# EAGLE design new_esplay (EAGLE 9.4.2)

## Sheet 1 of 2: Main Processor
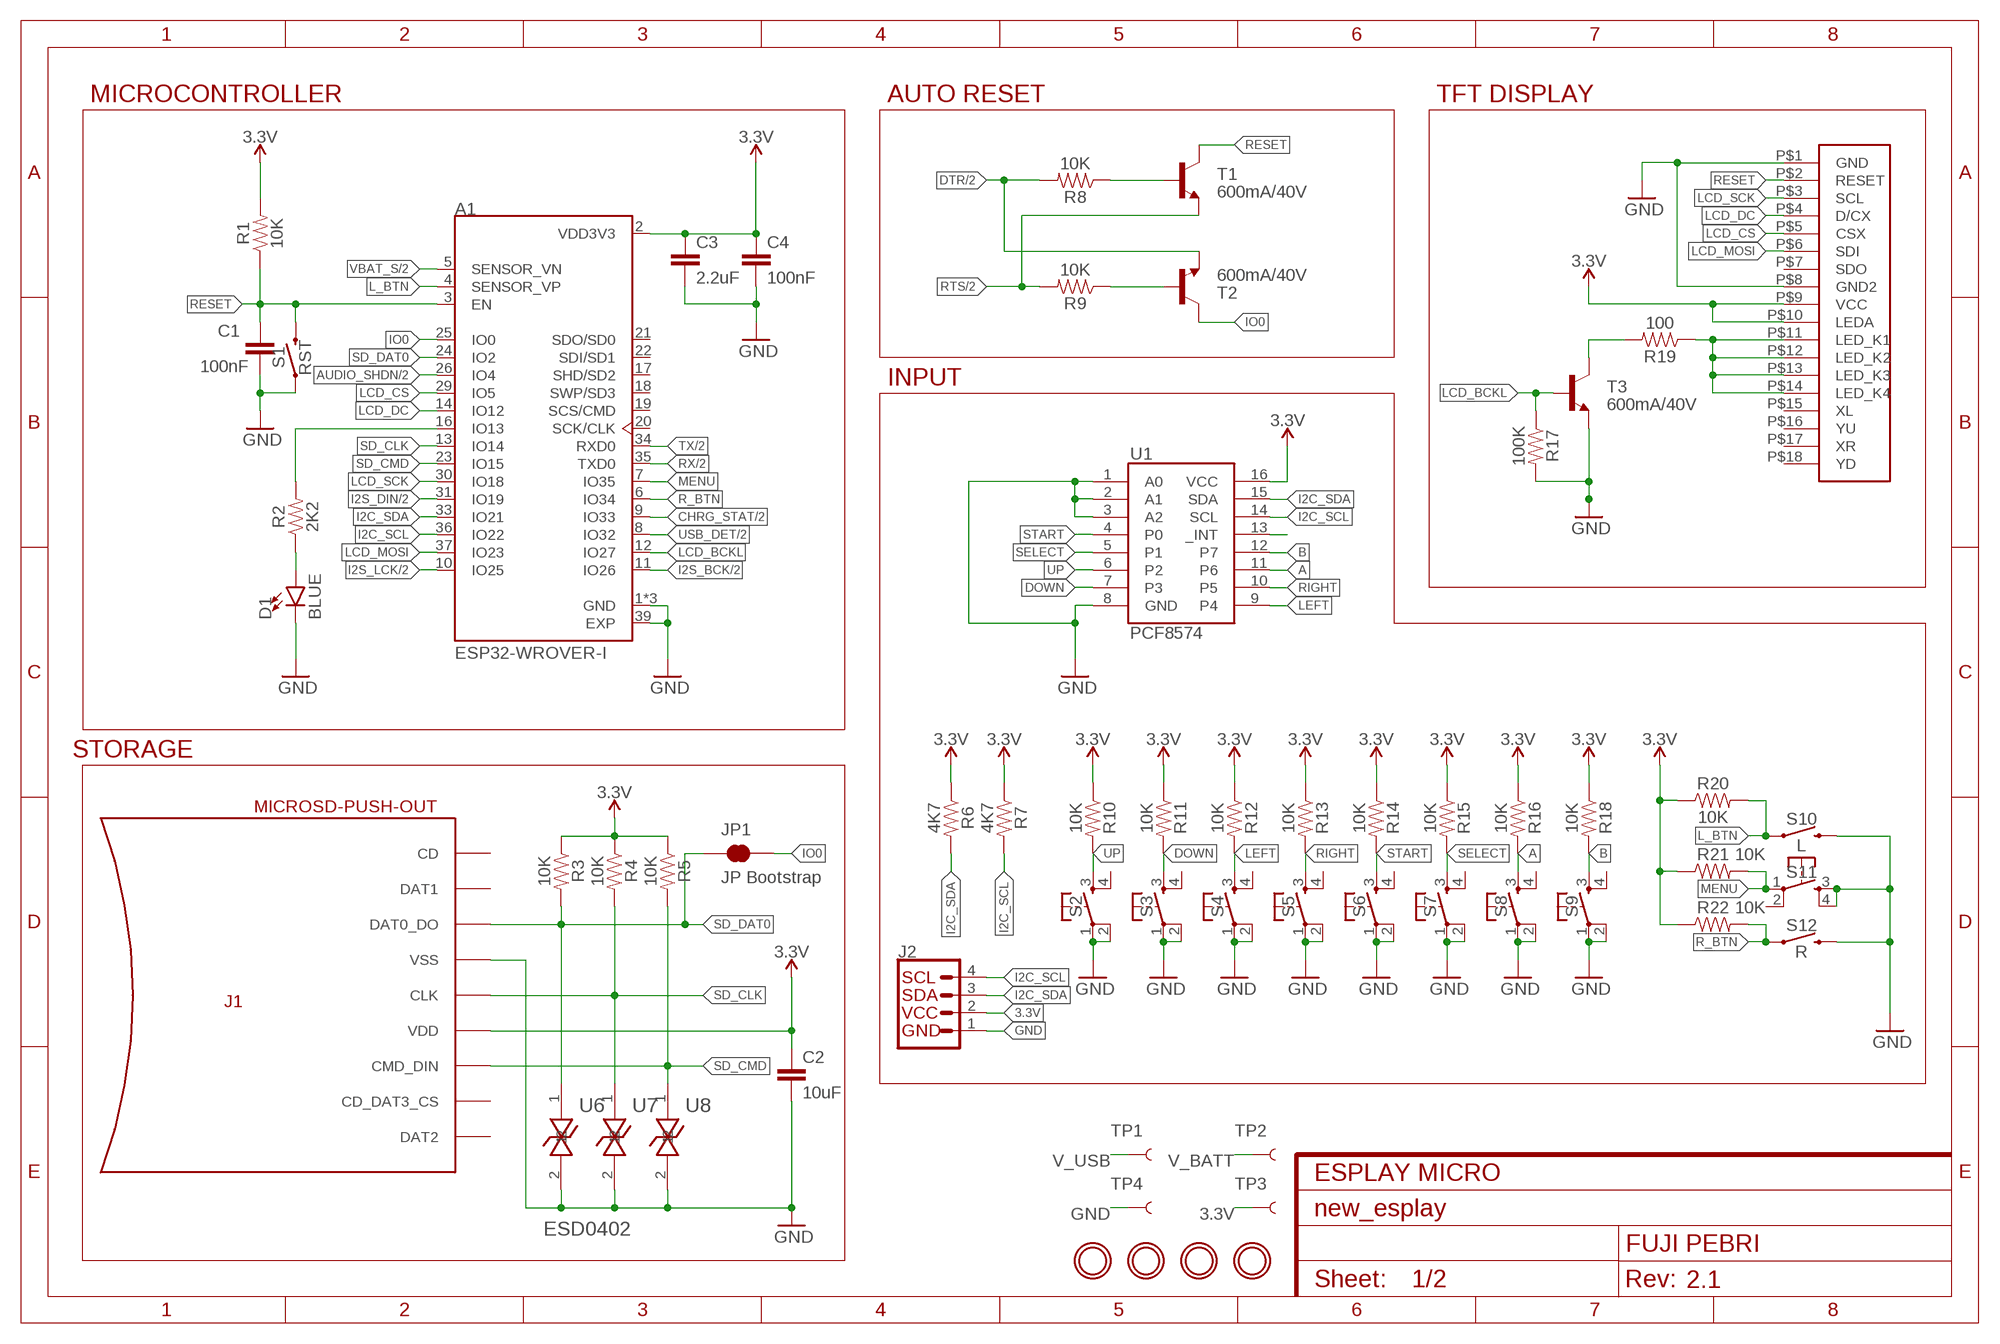
[diagram p0: schematic, sheet 1]
FRAME1 (FRAME-A4L): CNAME: ESPLAY MICRO; CREVISION: 2.1; DESIGNER: FUJI PEBRI

### Parts
A1  ESP32-WROVER-I  [XCVR_ESP32-WROVER-I]
C1  100nF  2.2UF-0805-25V-(+80/-20%)  [0805]
C2  10uF  2.2UF-0805-25V-(+80/-20%)  [0805]
C3  2.2uF  2.2UF-0805-25V-(+80/-20%)  [0805]
C4  100nF  2.2UF-0805-25V-(+80/-20%)  [0805]
D1  BLUE  LED-BLUE0603  [LED-0603]
H1  MICROBUILDER_MOUNTINGHOLE3.0THIN  [MICROBUILDER_MOUNTINGHOLE_3.0_PLATEDTHIN]
H2  MICROBUILDER_MOUNTINGHOLE3.0THIN  [MICROBUILDER_MOUNTINGHOLE_3.0_PLATEDTHIN]
H3  MICROBUILDER_MOUNTINGHOLE3.0THIN  [MICROBUILDER_MOUNTINGHOLE_3.0_PLATEDTHIN]
H4  MICROBUILDER_MOUNTINGHOLE3.0THIN  [MICROBUILDER_MOUNTINGHOLE_3.0_PLATEDTHIN]
J1  MICROSD-PUSH-OUT  [MICROSD-PUSH-OUT]
J2  QWIIC_CONNECTORJS-1MM  [1X04_1MM_RA]
JP1  JP Bootstrap  JUMPER-SMT_2_NC_TRACE_NO-SILK  [SMT-JUMPER_2_NC_TRACE_NO-SILK]
LCD1  ILI9341-2.4  [ILI9341-2.4]
R1  10K  0.22OHM-0805-1/4W-1%  [0805]
R2  2K2  0.22OHM-0805-1/4W-1%  [0805]
R3  10K  0.22OHM-0805-1/4W-1%  [0805]
R4  10K  0.22OHM-0805-1/4W-1%  [0805]
R5  10K  0.22OHM-0805-1/4W-1%  [0805]
R6  4K7  0.22OHM-0805-1/4W-1%  [0805]
R7  4K7  0.22OHM-0805-1/4W-1%  [0805]
R8  10K  0.22OHM-0805-1/4W-1%  [0805]
R9  10K  0.22OHM-0805-1/4W-1%  [0805]
R10  10K  0.22OHM-0805-1/4W-1%  [0805]
R11  10K  0.22OHM-0805-1/4W-1%  [0805]
R12  10K  0.22OHM-0805-1/4W-1%  [0805]
R13  10K  0.22OHM-0805-1/4W-1%  [0805]
R14  10K  0.22OHM-0805-1/4W-1%  [0805]
R15  10K  0.22OHM-0805-1/4W-1%  [0805]
R16  10K  0.22OHM-0805-1/4W-1%  [0805]
R17  100K  0.22OHM-0805-1/4W-1%  [0805]
R18  10K  0.22OHM-0805-1/4W-1%  [0805]
R19  100  0.22OHM-0805-1/4W-1%  [0805]
R20  10K  0.22OHM-0805-1/4W-1%  [0805]
R21  10K  0.22OHM-0805-1/4W-1%  [0805]
R22  10K  0.22OHM-0805-1/4W-1%  [0805]
S1  RST  MOMENTARY-SWITCH-SPST-SMD-4.6X2.8MM  [TACTILE_SWITCH_SMD_4.6X2.8MM]
S2  MOMENTARY-SWITCH-SPST-2-SMD-5.2MM  [TACTILE_SWITCH_SMD_5.2MM]
S3  MOMENTARY-SWITCH-SPST-2-SMD-5.2MM  [TACTILE_SWITCH_SMD_5.2MM]
S4  MOMENTARY-SWITCH-SPST-2-SMD-5.2MM  [TACTILE_SWITCH_SMD_5.2MM]
S5  MOMENTARY-SWITCH-SPST-2-SMD-5.2MM  [TACTILE_SWITCH_SMD_5.2MM]
S6  MOMENTARY-SWITCH-SPST-2-SMD-5.2MM  [TACTILE_SWITCH_SMD_5.2MM]
S7  MOMENTARY-SWITCH-SPST-2-SMD-5.2MM  [TACTILE_SWITCH_SMD_5.2MM]
S8  MOMENTARY-SWITCH-SPST-2-SMD-5.2MM  [TACTILE_SWITCH_SMD_5.2MM]
S9  MOMENTARY-SWITCH-SPST-2-SMD-5.2MM  [TACTILE_SWITCH_SMD_5.2MM]
S10  L  MOMENTARY-SWITCH-SPST-PTH-RIGHT-ANGLE-KIT  [TACTILE_SWITCH_PTH_RIGHT_ANGLE_KIT]
S11  MOMENTARY-SWITCH-SPST-2-SMD-5.2MM  [TACTILE_SWITCH_SMD_5.2MM]
S12  R  MOMENTARY-SWITCH-SPST-PTH-RIGHT-ANGLE-KIT  [TACTILE_SWITCH_PTH_RIGHT_ANGLE_KIT]
T1  600mA/40V  TRANS_NPN-MMBT2222AL  [SOT23-3]
T2  600mA/40V  TRANS_NPN-MMBT2222AL  [SOT23-3]
T3  600mA/40V  TRANS_NPN-MMBT2222AL  [SOT23-3]
TP1  TEST-POINT3  [PAD.03X.03]
TP2  TEST-POINT3  [PAD.03X.03]
TP3  TEST-POINT3  [PAD.03X.03]
TP4  TEST-POINT3  [PAD.03X.03]
U1  PCF8574  [SO16]
U6  ESD0402  [ESD0402]
U7  ESD0402  [ESD0402]
U8  ESD0402  [ESD0402]

### Nets
3.3V [3V3]: A1.2(VDD3V3) C2.1 C3.1 C4.1 J1.4(VDD) J2.2 LCD1.P$9(VCC) LCD1.P$10(LEDA) R1.2 R3.1 R4.1 R5.1 R6.1 R7.1 R10.1 R11.1 R12.1 R13.1 R14.1 R15.1 R16.1 R18.1 R20.1 R21.1 R22.1 TP3.P$1 U1.16(VCC) ; also sheet 2
A: R16.2 S8.3 U1.11(P6)
AUDIO_SHDN: A1.26(IO4) ; also sheet 2
B: R18.2 S9.3 U1.12(P7)
CHRG_STAT: A1.9(IO33) ; also sheet 2
DOWN: R11.2 S3.3 U1.7(P3)
DTR: R8.2 T2.2(E) ; also sheet 2
GND: A1.1(GND) A1.15(GND) A1.38(GND) A1.39(EXP) C1.2 C2.2 C3.2 C4.2 D1.C J1.6(VSS) J1.G1(VSS) J1.G2(VSS) J1.G3(VSS) J1.G4(VSS) J2.1 LCD1.P$1(GND) LCD1.P$8(GND2) R17.2 S1.1 S1.2 S2.1 S2.2 S3.1 S3.2 S4.1 S4.2 S5.1 S5.2 S6.1 S6.2 S7.1 S7.2 S8.1 S8.2 S9.1 S9.2 S10.2 S11.3 S11.4 S12.2 T3.2(E) TP4.P$1 U1.1(A0) U1.2(A1) U1.3(A2) U1.8(GND) U6.2 U7.2 U8.2 ; also sheet 2
I2C_SCL: A1.36(IO22) J2.4 R7.2 U1.14(SCL)
I2C_SDA: A1.33(IO21) J2.3 R6.2 U1.15(SDA)
I2S_BCK: A1.11(IO26) ; also sheet 2
I2S_DIN: A1.31(IO19) ; also sheet 2
I2S_LCK: A1.10(IO25) ; also sheet 2
IO0: A1.25(IO0) JP1.2 T2.3(C)
L_BTN: A1.4(SENSOR_VP) R20.2 S10.1
LCD_BCKL: A1.12(IO27) R17.1 T3.1(B)
LCD_CS: A1.29(IO5) LCD1.P$5(CSX)
LCD_DC: A1.14(IO12) LCD1.P$4(D/CX)
LCD_MOSI: A1.37(IO23) LCD1.P$6(SDI)
LCD_SCK: A1.30(IO18) LCD1.P$3(SCL)
LEFT: R12.2 S4.3 U1.9(P4)
MENU: A1.7(IO35) R21.2 S11.1
N$1: A1.16(IO13) R2.2
N$3: D1.A R2.1
N$9: R19.2 T3.3(C)
N$11: LCD1.P$11(LED_K1) LCD1.P$12(LED_K2) LCD1.P$13(LED_K3) LCD1.P$14(LED_K4) R19.1
N$12: R8.1 T1.1(B)
N$13: R9.1 T2.1(B)
N$33: U1.13(_INT)
R_BTN: A1.6(IO34) R22.2 S12.1
RESET: A1.3(EN) C1.1 LCD1.P$2(RESET) R1.1 S1.3 S1.4 T1.3(C)
RIGHT: R13.2 S5.3 U1.10(P5)
RTS: R9.2 T1.2(E) ; also sheet 2
RX: A1.35(TXD0) ; also sheet 2
SD_CLK: A1.13(IO14) J1.5(CLK) R4.2 U7.1
SD_CMD: A1.23(IO15) J1.3(CMD_DIN) R5.2 U8.1
SD_DAT0: A1.24(IO2) J1.7(DAT0_DO) JP1.1 R3.2 U6.1
SELECT: R15.2 S7.3 U1.5(P1)
START: R14.2 S6.3 U1.4(P0)
TX: A1.34(RXD0) ; also sheet 2
UP: R10.2 S2.3 U1.6(P2)
USB_DET: A1.8(IO32) ; also sheet 2
V_BATT [VBUS]: TP2.P$1 ; also sheet 2
V_USB [VBUS]: TP1.P$1 ; also sheet 2
VBAT_S: A1.5(SENSOR_VN) ; also sheet 2
Unconnected: A1.17(SHD/SD2) A1.18(SWP/SD3) A1.19(SCS/CMD) A1.20(SCK/CLK) A1.21(SDO/SD0) A1.22(SDI/SD1) J1.1(DAT2) J1.2(CD_DAT3_CS) J1.8(DAT1) J1.CD LCD1.P$7(SDO) LCD1.P$15(XL) LCD1.P$16(YU) LCD1.P$17(XR) LCD1.P$18(YD) S2.4 S3.4 S4.4 S5.4 S6.4 S7.4 S8.4 S9.4 S11.2

### Notes on the sheet
- MICROCONTROLLER | AUTO RESET | TFT DISPLAY
- INPUT
- STORAGE

## Sheet 2 of 2: Power Supply and Charger
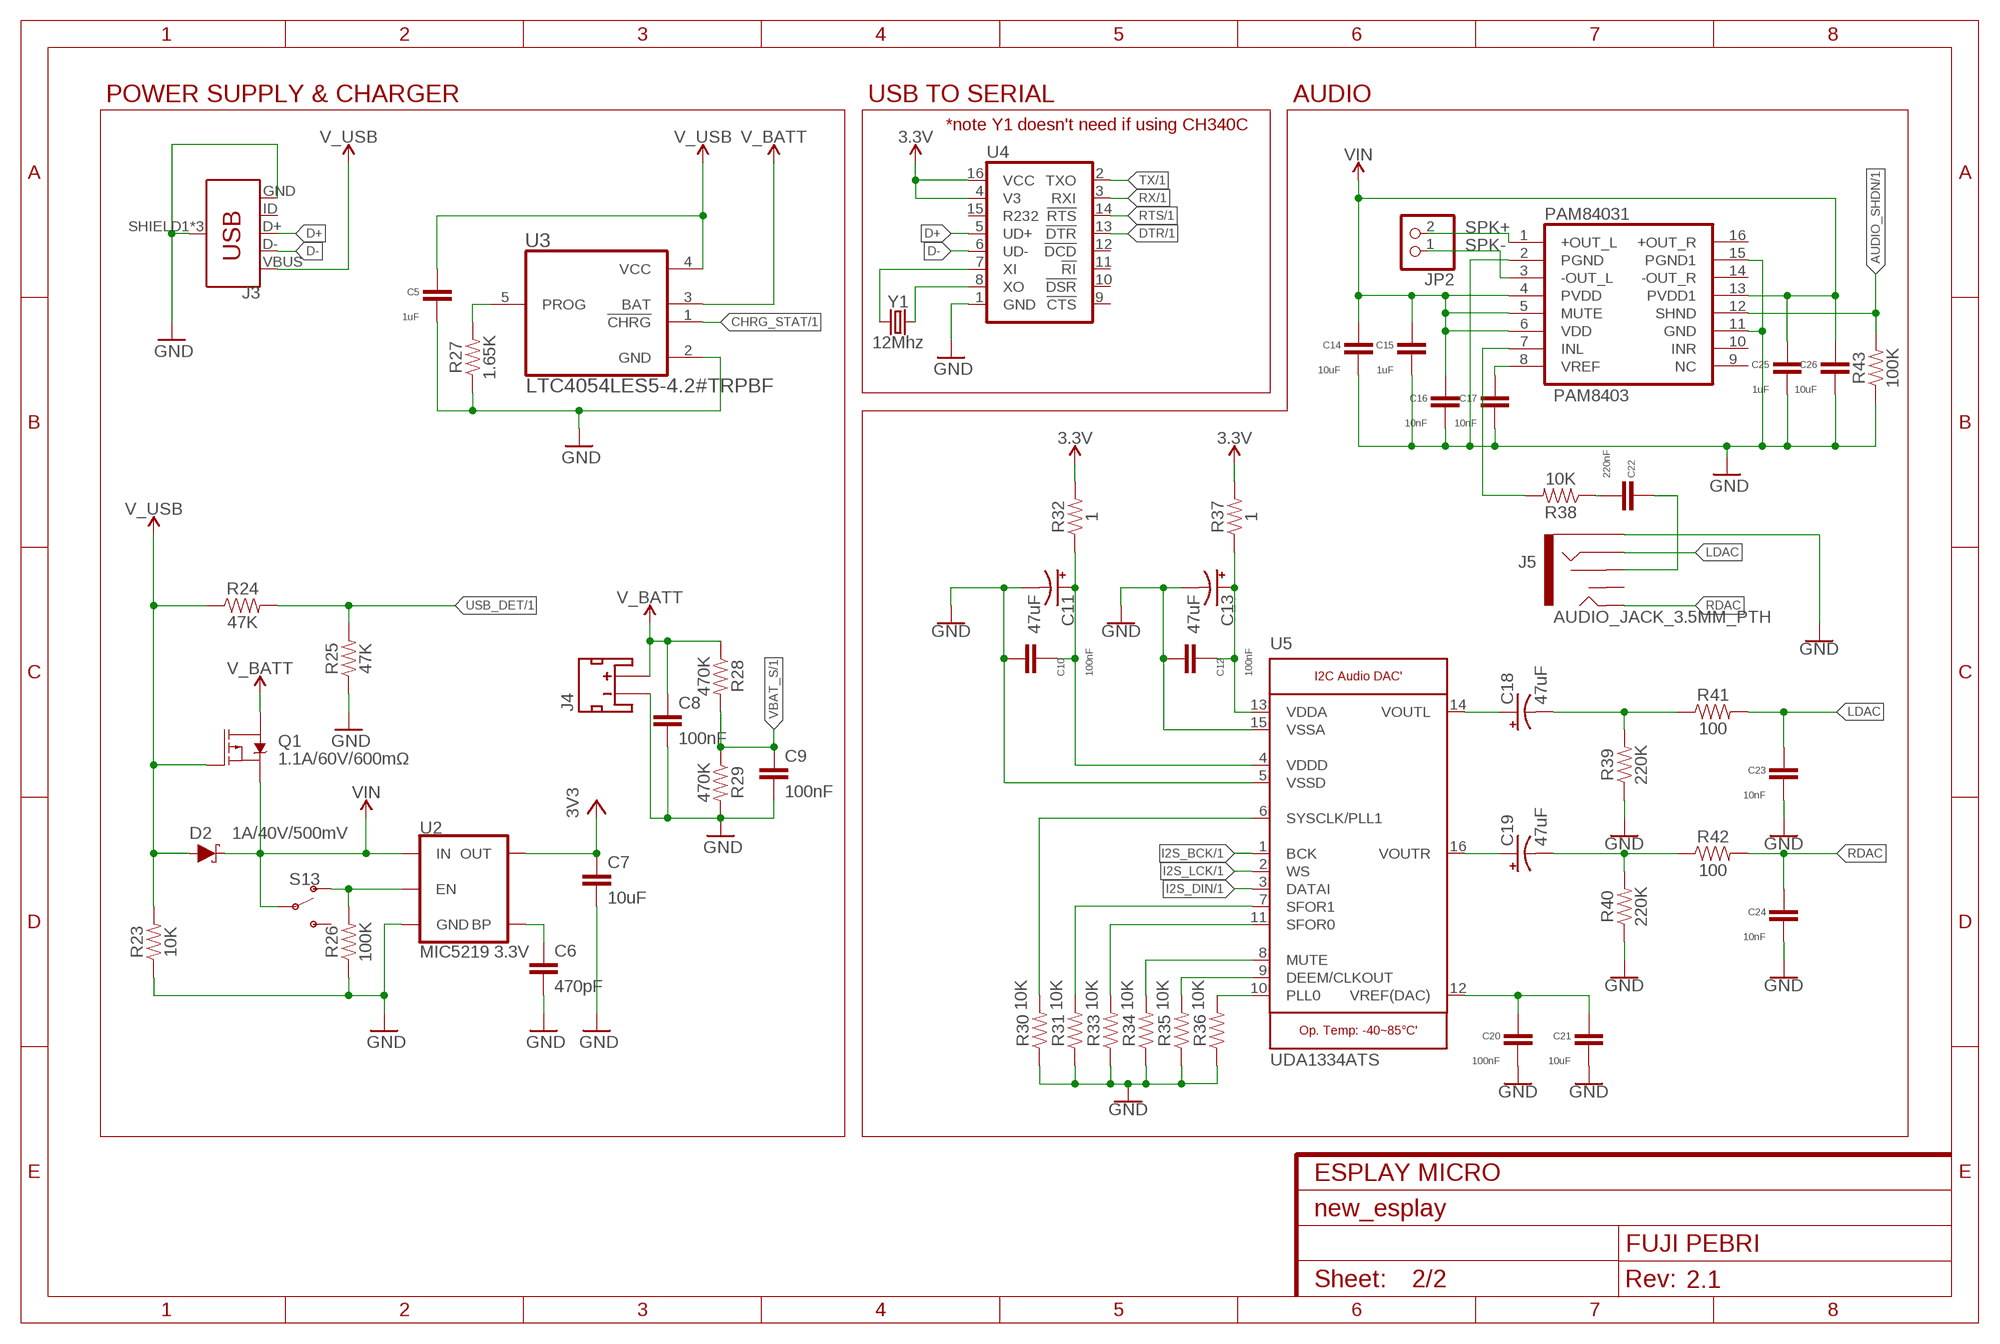
[diagram p1: schematic, sheet 2]
FRAME2 (FRAME-A4L): CNAME: ESPLAY MICRO; CREVISION: 2.1; DESIGNER: FUJI PEBRI

### Parts
C5  1uF  2.2UF-0805-25V-(+80/-20%)  [0805]
C6  470pF  2.2UF-0805-25V-(+80/-20%)  [0805]
C7  10uF  2.2UF-0805-25V-(+80/-20%)  [0805]
C8  100nF  2.2UF-0805-25V-(+80/-20%)  [0805]
C9  100nF  2.2UF-0805-25V-(+80/-20%)  [0805]
C10  100nF  2.2UF-0805-25V-(+80/-20%)  [0805]
C11  47uF  47UF-POLAR-EIA3528-10V-10%  [EIA3528]
C12  100nF  2.2UF-0805-25V-(+80/-20%)  [0805]
C13  47uF  47UF-POLAR-EIA3528-10V-10%  [EIA3528]
C14  10uF  2.2UF-0805-25V-(+80/-20%)  [0805]
C15  1uF  2.2UF-0805-25V-(+80/-20%)  [0805]
C16  10nF  2.2UF-0805-25V-(+80/-20%)  [0805]
C17  10nF  2.2UF-0805-25V-(+80/-20%)  [0805]
C18  47uF  47UF-POLAR-EIA3528-10V-10%  [EIA3528]
C19  47uF  47UF-POLAR-EIA3528-10V-10%  [EIA3528]
C20  100nF  2.2UF-0805-25V-(+80/-20%)  [0805]
C21  10uF  2.2UF-0805-25V-(+80/-20%)  [0805]
C22  220nF  2.2UF-0805-25V-(+80/-20%)  [0805]
C23  10nF  2.2UF-0805-25V-(+80/-20%)  [0805]
C24  10nF  2.2UF-0805-25V-(+80/-20%)  [0805]
C25  1uF  2.2UF-0805-25V-(+80/-20%)  [0805]
C26  10uF  2.2UF-0805-25V-(+80/-20%)  [0805]
D2  1A/40V/500mV  DIODE-SCHOTTKY-SS14  [SMA-DIODE]
J3  USB_MICRO-B_FEMALE-SMT  [USB-B-MICRO-SMD]
J4  JST_2MM_MALE  [JST-2-SMD]
J5  AUDIO_JACK_3.5MM_PTH  [AUDIO-JACK]
JP2  PINHD-1X2_2.00  [1X02M]
PAM84031  PAM8403  [SOP-16]
Q1  1.1A/60V/600mΩ  MOSFET_PCH-SI2309DS  [SOT23-3]
R23  10K  0.22OHM-0805-1/4W-1%  [0805]
R24  47K  0.22OHM-0805-1/4W-1%  [0805]
R25  47K  0.22OHM-0805-1/4W-1%  [0805]
R26  100K  0.22OHM-0805-1/4W-1%  [0805]
R27  1.65K  0.3OHM-0805-1/8W-1%  [0805]
R28  470K  0.22OHM-0805-1/4W-1%  [0805]
R29  470K  0.22OHM-0805-1/4W-1%  [0805]
R30  10K  0.3OHM-0805-1/8W-1%  [0805]
R31  10K  0.3OHM-0805-1/8W-1%  [0805]
R32  1  0.3OHM-0805-1/8W-1%  [0805]
R33  10K  0.3OHM-0805-1/8W-1%  [0805]
R34  10K  0.3OHM-0805-1/8W-1%  [0805]
R35  10K  0.3OHM-0805-1/8W-1%  [0805]
R36  10K  0.3OHM-0805-1/8W-1%  [0805]
R37  1  0.3OHM-0805-1/8W-1%  [0805]
R38  10K  0.3OHM-0805-1/8W-1%  [0805]
R39  220K  0.3OHM-0805-1/8W-1%  [0805]
R40  220K  0.3OHM-0805-1/8W-1%  [0805]
R41  100  0.3OHM-0805-1/8W-1%  [0805]
R42  100  0.3OHM-0805-1/8W-1%  [0805]
R43  100K  0.3OHM-0805-1/8W-1%  [0805]
S13  SWITCH-SPDT-SMD-RIGHT-ANGLE  [SWITCH_SPST_SMD_A]
U2  MIC5219 3.3V  V_REG_MIC52193.3V  [SOT23-5]
U3  LTC4054LES5-4.2#TRPBF  [SOT95P280X100-5N]
U4  CH340G  CH340GSMD  [SO016]
U5  UDA1334ATS  MICROBUILDER_AUDIO_I2S_UDA1334""  [MICROBUILDER_SSOP16_4.4MM]
Y1  12Mhz  CRYSTALSMD-5X3.2-4PAD  [CRYSTAL-SMD-5X3.2-4PAD]

### Nets
3.3V [3V3]: C7.1 R32.2 R37.2 U2.5(OUT) U4.4(V3) U4.16(VCC) ; supply symbol labelled 3V3 ; also sheet 1
AUDIO_SHDN: PAM84031.12(SHND) R43.2 ; also sheet 1
CHRG_STAT: U3.1(!CHRG) ; also sheet 1
D+: J3.D+ U4.5(UD+)
D-: J3.D- U4.6(UD-)
DTR: U4.13(!DTR) ; also sheet 1
GND: C5.1 C6.2 C7.2 C8.2 C9.2 C10.1 C11.C(-) C12.1 C13.C(-) C14.1 C15.1 C16.1 C17.1 C20.1 C21.1 C23.1 C24.1 C25.1 C26.1 J3.GND J3.SHIELD1(SHIELD) J3.SHIELD2(SHIELD) J3.SHIELD3(SHIELD) J4.1(-) J5.SLEEVE PAM84031.2(PGND) PAM84031.11(GND) PAM84031.15(PGND1) R23.1 R25.1 R26.1 R27.1 R29.2 R30.1 R31.1 R33.1 R34.1 R35.1 R36.1 R39.1 R40.1 R43.1 U2.2(GND) U3.2(GND) U4.1(GND) U5.5(VSSD) U5.15(VSSA) ; also sheet 1
I2S_BCK: U5.1(BCK) ; also sheet 1
I2S_DIN: U5.3(DATAI) ; also sheet 1
I2S_LCK: U5.2(WS) ; also sheet 1
LDAC: C23.2 J5.RING R41.2
N$2: R27.2 U3.5(PROG)
N$4: U4.7(XI) Y1.3
N$5: C18.A(+) U5.14(VOUTL)
N$6: U4.8(XO) Y1.1
N$7: R26.2 S13.1(O) U2.3(EN)
N$10: C6.1 U2.4(BP)
N$14: C19.A(+) U5.16(VOUTR)
N$16: C17.2 PAM84031.8(VREF)
N$17: PAM84031.7(INL) R38.2
N$18: C18.C(-) R39.2 R41.1
N$19: C19.C(-) R40.2 R42.1
N$20: C12.2 C13.A(+) R37.1 U5.13(VDDA)
N$21: C20.2 C21.2 U5.12(VREF(DAC))
N$22: C10.2 C11.A(+) R32.1 U5.4(VDDD)
N$23: C22.1 R38.1
N$24: R30.2 U5.6(SYSCLK/PLL1)
N$25: R31.2 U5.7(SFOR1)
N$26: R33.2 U5.11(SFOR0)
N$27: R34.2 U5.8(MUTE)
N$28: R35.2 U5.9(DEEM/CLKOUT)
N$29: R36.2 U5.10(PLL0)
N$30: C22.2 J5.RSH
RDAC: C24.2 J5.TIP R42.2
RTS: U4.14(!RTS) ; also sheet 1
RX: U4.3(RXI) ; also sheet 1
SPK+ [3V3]: JP2.2 PAM84031.1(+OUT_L)
SPK- [3V3]: JP2.1 PAM84031.3(-OUT_L)
TX: U4.2(TXO) ; also sheet 1
USB_DET: R24.2 R25.2 ; also sheet 1
V_BATT [VBUS]: C8.1 J4.2(+) Q1.3(D) R28.1 U3.3(BAT) ; also sheet 1
V_USB [VBUS]: C5.2 D2.A J3.VBUS Q1.1(G) R23.2 R24.1 U3.4(VCC) ; also sheet 1
VBAT_S: C9.1 R28.2 R29.1 ; also sheet 1
VIN [3V3]: C14.2 C15.2 C16.2 C25.2 C26.2 D2.C PAM84031.4(PVDD) PAM84031.5(MUTE) PAM84031.6(VDD) PAM84031.13(PVDD1) Q1.2(S) S13.2(P) U2.1(IN)
Unconnected: J3.ID J4.NC1(PAD1) J4.NC2(PAD2) J5.TSH PAM84031.9(NC) PAM84031.10(INR) PAM84031.14(-OUT_R) PAM84031.16(+OUT_R) S13.3(S) U4.9(!CTS) U4.10(!DSR) U4.11(!RI) U4.12(!DCD) U4.15(R232)

### Notes on the sheet
- POWER SUPPLY & CHARGER | USB TO SERIAL | AUDIO
- *note Y1 doesn't need if using CH340C

## Library data of the parts
A1 = ESP32-WROVER-I:ESP32-WROVER-I: Module: combo; GPIO, I2C x2, I2S x2, SDIO, SPI x3, UART x3; U.FL; AVAILABILITY: Unavailable; DESCRIPTION: Module: combo; GPIO, I2C x2, I2S x2, SDIO, SPI x3, UART x3; U.FL; MF: Espressif Systems; MP: ESP32-WROVER-I; PACKAGE: Module Espressif Systems; PRICE: None
C1 C2 C4-C10 C12 C14-C17 C20-C26 = SparkFun-Capacitors:2.2UF: 2.2µF ceramic capacitors A capacitor is a passive two-terminal electrical component used to store electrical energy temporarily in an electric field.; PROD_ID: CAP-11624; VALUE: 2.2uF
C3 = SparkFun-Capacitors:2.2UF: 2.2µF ceramic capacitors A capacitor is a passive two-terminal electrical component used to store electrical energy temporarily in an electric field.; PROD_ID: CAP-11624
C11 C13 C18 C19 = SparkFun-Capacitors:47UF-POLAR: 47µF polarized capacitors A capacitor is a passive two-terminal electrical component used to store electrical energy temporarily in an electric field.; PROD_ID: CAP-08310
D1 = SparkFun-LED:LED-BLUE: Blue SMD LED Used in manufacturing of various products at SparkFun Packages: 0603 - SMD 0603 package [Product Link] <http://www.digikey.com/product-detail/en/SMLE12BC7TT86/511-1589-2-ND/1641808> 1206 - SMD1206 package [Product Link] <http://www.digikey.com/product-detail/en/lite-on-inc/LTST-C150TBKT/160-1643-1-ND/573584> SparkFun Products: ESP8266 Thing-Dev Board <https://www.sparkfun.com/products/13711> RedBoard <https://www.sparkfun.com/products/12757>; PROD_ID: DIO-08575
D2 = SparkFun-DiscreteSemi:DIODE-SCHOTTKY: Schottky diode A Schottky diode is a semiconductor diode which has a low forward voltage drop and a very fast switching action.; PROD_ID: DIO-08053
H1-H4 = Adafruit UDA1334 I2S DAC:MICROBUILDER_MOUNTINGHOLE: Mounting Hole For #2 screws (0.086"/2.18mm width, 0.094"/2.4mm hole) use 2.5mm; BOM: EXCLUDE
J1 = microsd:MICROSD-PUSH-OUT: T-Flash Push-Out Micro SD Card Reader 14.75mm x 14.5mm SMD with external pins
J2 = SparkFun-Connectors:QWIIC_CONNECTOR: SparkFun I2C Standard Qwiic Connector An SMD 1mm pitch JST connector makes it easy and quick (get it? Qwiic?) to connect I2C devices to each other. The Qwiic system <http://www.sparkfun.com/qwiic> enables fast and solderless connection between popular platforms and various sensors and actuators. We carry 200mm <https://www.sparkfun.com/products/14204>, 100mm <https://www.sparkfun.com/products/14205>, 50mm <https://www.sparkfun.com/products/14206>, and breadboard friendly <https://www.sparkfun.com/products/14207> Qwiic cables. We also offer 10 pcs strips <https://www.sparkfun.com/products/14323> the SMD connectors.; PROD_ID: CONN-13694
J3 = SparkFun-Connectors:USB_MICRO-B: USB Type Micro-B Connector Male/female and PTH/SMT variants SparkFun Products: SparkFun microB USB Breakout <https://www.sparkfun.com/products/12035> SparkFun USB microB Plug Breakout <https://www.sparkfun.com/products/10031> SparkFun ESP8266 Thing <https://www.sparkfun.com/products/13231>; PROD_ID: CONN-11752
J4 = SparkFun-Connectors:JST_2MM_MALE: JST 2MM MALE RA CONNECTOR Two pin, compact surface mount connector. Commonly used as a battery input connection point. We really like the solid locking feeling and high current rating on these small connectors. We use these all the time as battery connectors. Mates to single-cell LiPo batteries. Here is the connector we sell at SparkFun: JST Right Angle Connector - White <https://www.sparkfun.com/products/8612> (PRT-08612) Datasheet <http://www.sparkfun.com/datasheets/Prototyping/Connectors/JST-Horizontal.pdf> It was used on these SparkFun products: SparkFun MOSFET Power Controller <https://www.sparkfun.com/products/11214> (PRT-11214) SparkFun Battery Babysitter - LiPo Battery Manager <https://www.sparkfun.com/products/13777> (PRT-13777) And many, many others that required a lipo battery connection.; PROD_ID: CONN-11443; SF_ID: PRT-08612
J5 = SparkFun-Connectors:AUDIO_JACK_3.5MM: Audio Jack 3.5mm variants of PTH and SMT stereo audio jack with bypass switches. SparkFun Products: SparkFun SparkPunk Sound Kit <[https://www.sparkfun.com/products/11177]> - PTH MP3 Trigger <https://www.sparkfun.com/products/13720> -3.5mm SMD SparkFun PicoBoard <https://www.sparkfun.com/products/11888>- 2.5mm SMD; PROD_ID: CONN-08774; SF_ID: PRT-08032
JP1 = SparkFun-Jumpers:JUMPER-SMT_2_NC_TRACE: Normally closed trace jumper This jumper has a trace between two pads so it's normally closed (NC). Use a razor knife to open the connection. For best results follow the IPC guidelines for cutting traces: Cutout at least 0.063 mm (0.005 in). Remove all loose material to clean up the cut area. Seal the cut with an approved epoxy. Reapply solder to reclose the connection.
JP2 = pinhead-1:PINHD-1X2: PIN HEADER
LCD1 = TFTDisplays:ILI9341-2.4
PAM84031 = PAM8403:PAM8403: Dual channel audio amplifier IC - PAM8403
Q1 = SparkFun-DiscreteSemi:MOSFET_PCH: P-channel MOSFETs Voltage controlled devices that allow control of high current outputs. SparkFun Products: SparkFun ESP32 Thing <https://www.sparkfun.com/products/13907> SparkFun ESP8266 Thing <https://www.sparkfun.com/products/13231>; PROD_ID: TRANS-08285
R1-R26 R28 R29 = SparkFun-Resistors:0.22OHM: 0.22Ω resistor A resistor is a passive two-terminal electrical component that implements electrical resistance as a circuit element. Resistors act to reduce current flow, and, at the same time, act to lower voltage levels within circuits. - Wikipedia; PROD_ID: RES-09883; VALUE: 0.22
R27 R30-R43 = SparkFun-Resistors:0.3OHM: 0.3Ω resistor A resistor is a passive two-terminal electrical component that implements electrical resistance as a circuit element. Resistors act to reduce current flow, and, at the same time, act to lower voltage levels within circuits. - Wikipedia; PROD_ID: RES-11622; VALUE: 0.3
S1 = SparkFun-Switches:MOMENTARY-SWITCH-SPST: Momentary Switch (Pushbutton) - SPST Normally-open (NO) SPST momentary switches (buttons, pushbuttons). Variants PTH-12MM - 12mm square, through-hole Momentary Pushbutton Switch - 12mm Square <https://www.sparkfun.com/products/9190> (COM-09190) PTH-6.0MM, PTH-6.0MM-KIT - 6.0mm square, through-hole Mini Pushbutton Switch <https://www.sparkfun.com/products/97> (COM-00097) KIT package intended for soldering kit's - only one side of pads' copper is exposed. PTH-RIGHT-ANGLE-KIT - Right-angle, through-hole Right Angle Tactile Button <https://www.sparkfun.com/products/10791> - Used on SparkFun BigTime Watch Kit <https://www.sparkfun.com/products/11734> SMD-12MM - 12mm square, surface-mount Tactile Button - SMD (12mm) <https://www.sparkfun.com/products/12993> (COM-12993) Used on SparkFun PicoBoard <https://www.sparkfun.com/products/11888> SMD-4.5MM - 4.5mm Square Trackball Switch Used on SparkFun Blackberry Trackballer Breakout <https://www.sparkfun.com/products/13169> SMD-4.6MMX2.8MM - 4.60mm x 2.80mm, surface mount Used on SparkFun SAMD21 Mini Breakout <https://www.sparkfun.com/products/13664> SMD-5.2MM, SMD-5.2-REDUNDANT - 5.2mm square, surface-mount Mini Pushbutton Switch - SMD <https://www.sparkfun.com/products/8720> (COM-08720) Used on Arduino Pro Mini <https://www.sparkfun.com/products/11114> REDUNDANT package connects both switch circuits together SMD-6.0X3.5MM - 6.0 x 3.5mm, surface mount Momentary Reset Switch SMD <https://www.sparkfun.com/products/8229> (COM-08229) SMD-6.2MM-TALL - 6.2mm square, surface mount Tactile Button - SMD (6mm) <https://www.sparkfun.com/products/12992> Used on SparkFun Digital Sandbox <https://www.sparkfun.com/products/12651> SMD-RIGHT-ANGLE - Right-angle, surface mount Used on SparkFun Block for Intel® Edison - Arduino <https://www.sparkfun.com/products/13036>; PROD_ID: SWCH-13065
S2-S9 S11 = SparkFun-Switches:MOMENTARY-SWITCH-SPST-2: Momentary Switch (Pushbutton) - SPST - Two Circuits Normally-open (NO) SPST momentary switches (buttons, pushbuttons). Schematic symbol includes two switch circuits. Variants SMD-4.6MMX2.8MM - 4.60mm x 2.80mm Tactile Momentary Button Switch - Used on SparkFun SAMD21 Mini Breakout <https://www.sparkfun.com/products/13664> SMD-5.2MM - Mini Pushbutton Switch - SMD <https://www.sparkfun.com/products/8720> - Used on Arduino Pro Mini <https://www.sparkfun.com/products/11114>; PROD_ID: SWCH-08247; SF_SKU: COM-08720
S10 S12 = SparkFun-Switches:MOMENTARY-SWITCH-SPST: Momentary Switch (Pushbutton) - SPST Normally-open (NO) SPST momentary switches (buttons, pushbuttons). Variants PTH-12MM - 12mm square, through-hole Momentary Pushbutton Switch - 12mm Square <https://www.sparkfun.com/products/9190> (COM-09190) PTH-6.0MM, PTH-6.0MM-KIT - 6.0mm square, through-hole Mini Pushbutton Switch <https://www.sparkfun.com/products/97> (COM-00097) KIT package intended for soldering kit's - only one side of pads' copper is exposed. PTH-RIGHT-ANGLE-KIT - Right-angle, through-hole Right Angle Tactile Button <https://www.sparkfun.com/products/10791> - Used on SparkFun BigTime Watch Kit <https://www.sparkfun.com/products/11734> SMD-12MM - 12mm square, surface-mount Tactile Button - SMD (12mm) <https://www.sparkfun.com/products/12993> (COM-12993) Used on SparkFun PicoBoard <https://www.sparkfun.com/products/11888> SMD-4.5MM - 4.5mm Square Trackball Switch Used on SparkFun Blackberry Trackballer Breakout <https://www.sparkfun.com/products/13169> SMD-4.6MMX2.8MM - 4.60mm x 2.80mm, surface mount Used on SparkFun SAMD21 Mini Breakout <https://www.sparkfun.com/products/13664> SMD-5.2MM, SMD-5.2-REDUNDANT - 5.2mm square, surface-mount Mini Pushbutton Switch - SMD <https://www.sparkfun.com/products/8720> (COM-08720) Used on Arduino Pro Mini <https://www.sparkfun.com/products/11114> REDUNDANT package connects both switch circuits together SMD-6.0X3.5MM - 6.0 x 3.5mm, surface mount Momentary Reset Switch SMD <https://www.sparkfun.com/products/8229> (COM-08229) SMD-6.2MM-TALL - 6.2mm square, surface mount Tactile Button - SMD (6mm) <https://www.sparkfun.com/products/12992> Used on SparkFun Digital Sandbox <https://www.sparkfun.com/products/12651> SMD-RIGHT-ANGLE - Right-angle, surface mount Used on SparkFun Block for Intel® Edison - Arduino <https://www.sparkfun.com/products/13036>; PROD_ID: CONN-10672; SF_SKU: COM-10791
S13 = SparkFun-Switches:SWITCH-SPDT: Single Pole, Double Throw (SPDT) Switch Single-pole, double-throw (SPDT) switch. Variant Overview SMD-AYZ0202 Surface Mount DPDT Switch <https://www.sparkfun.com/products/597> (COM-00597) Used on e.g. LilyPad Arduino USB - ATmega32U4 Board <https://www.sparkfun.com/products/12049> PTH-11.6X4.0MM SPDT Mini Power Switch <https://www.sparkfun.com/products/102> (COM-00102) Used on e.g. SparkFun Simon Says - Through-Hole Soldering Kit <https://www.sparkfun.com/products/10547> (KIT-10547) PTH-11.6X4.0MM-KIT KIT version of SPDT Mini Power Switch - Simplifies soldering by removing tStop of switch pins - only one side can be soldered. PTH-11.6X4.0MM-LOCK LOCK version of SPDT Mini Power Switch - Offset pins hold switch in place for easier soldering. SMD-RIGHT-ANGLE Surface Mount Right Angle Switch <https://www.sparkfun.com/products/10860> (COM-10860) Used on e.g. SparkFun ESP8266 Thing <https://www.sparkfun.com/products/13231>; PROD_ID: SWCH-10651; SF_SKU: COM-10860
T1-T3 = SparkFun-DiscreteSemi:TRANS_NPN: NPN transistor Current controlled devices typically used to amplify current or used as a switch. BC547 - COM-08928 <http://www.sparkfun.com/products/8928> (TO-92 45V 100mA) (1.Collector 2.Base 3.Emitter) 2N3904 - COM-00521 <http://www.sparkfun.com/products/521> (TO-92 40V 200mA) (1.Emitter 2.Base 3.Collector) P2N2222A - COM-12852 <http://www.sparkfun.com/products/12852> (TO-92 40V 600mA) (1.Collector 2.Base 3.Emitter); PROD_ID: TRANS-08049
TP1-TP4 = SparkFun-Connectors:TEST-POINT: SparkFun Test Points Bare copper test points for troubleshooting or In-Circuit-Testing. These are used by our Production team for verifying production board runs using pogo-pins on test beds. SparkFun Products: SparkFun LSM9DS1 Breakout <https://www.sparkfun.com/products/13284> SparkFun PSOC <https://www.sparkfun.com/products/13714> SparkFun Load Cell Amplifier <https://www.sparkfun.com/products/13879>
U1 = PCF8574:PCF8574; AVAILABILITY: Unavailable; DESCRIPTION: Remote 8-Bit I/O Expander for I2C-Bus; MF: Texas Instruments; MP: PCF8574; PACKAGE: SOIC-16 Texas Instruments; PRICE: None
U2 = SparkFun-IC-Power:V_REG_MIC5219: V_REG MIC5219 Standard 3.3V and 5V 500mA LDO voltage regulator in SOT-23 layout. Micrel part MIC5219. BP (by-pass) pin is used to lower output noise with 470pF cap, may be left open.; PROD_ID: VREG-09872
U3 = LTC4054LES5-4.2_TRPBF:LTC4054LES5-4.2#TRPBF: LTC4054L-4.2 - 150mA Standalone Linear Li-Ion Battery Charger in ThinSOT; DESCRIPTION: LTC4054L-4.2 - 150mA Standalone Linear Li-Ion Battery Charger in ThinSOT; DIGI-KEY_PART_NUMBER: LTC4054LES5-4.2#TRPBFCT-ND; DIGI-KEY_PURCHASE_URL: https://www.digikey.co.id/product-detail/en/linear-technology-analog-devices/LTC4054LES5-4.2-TRPBF/LTC4054LES5-4.2-TRPBFCT-ND/1888452?utm_source=snapeda&utm_medium=aggregator&utm_campaign=symbol; MF: Linear Technology/Analog; MP: LTC4054LES5-4.2#TRPBF; PACKAGE: SOT-23-5 Linear Technology
U4 = SparkFun-IC-Comms:CH340G: A simple USB 2.0 to Serial IC.; PROD_ID: IC-13498
U5 = Adafruit UDA1334 I2S DAC:MICROBUILDER_AUDIO_I2S_UDA1334: UDA1334 I2C Audio DAC Power Supply: 2.4-3.6V Sample frequencies from 16-100kHz
U6-U8 = ESDM3032MXT5G:ESD0402: None
Y1 = SparkFun-Clocks:CRYSTAL: Crystals (Generic) These are passive quartz crystals, which can be used as a clock source for a microcontroller. Crystal's are two-terminal devices. They require external "load" capacitors to generate an oscillating signal.

## Net classes
0 default: width 0.254 mm
1 VBUS: width 0.356 mm
2 3V3: width 0.305 mm

## Board
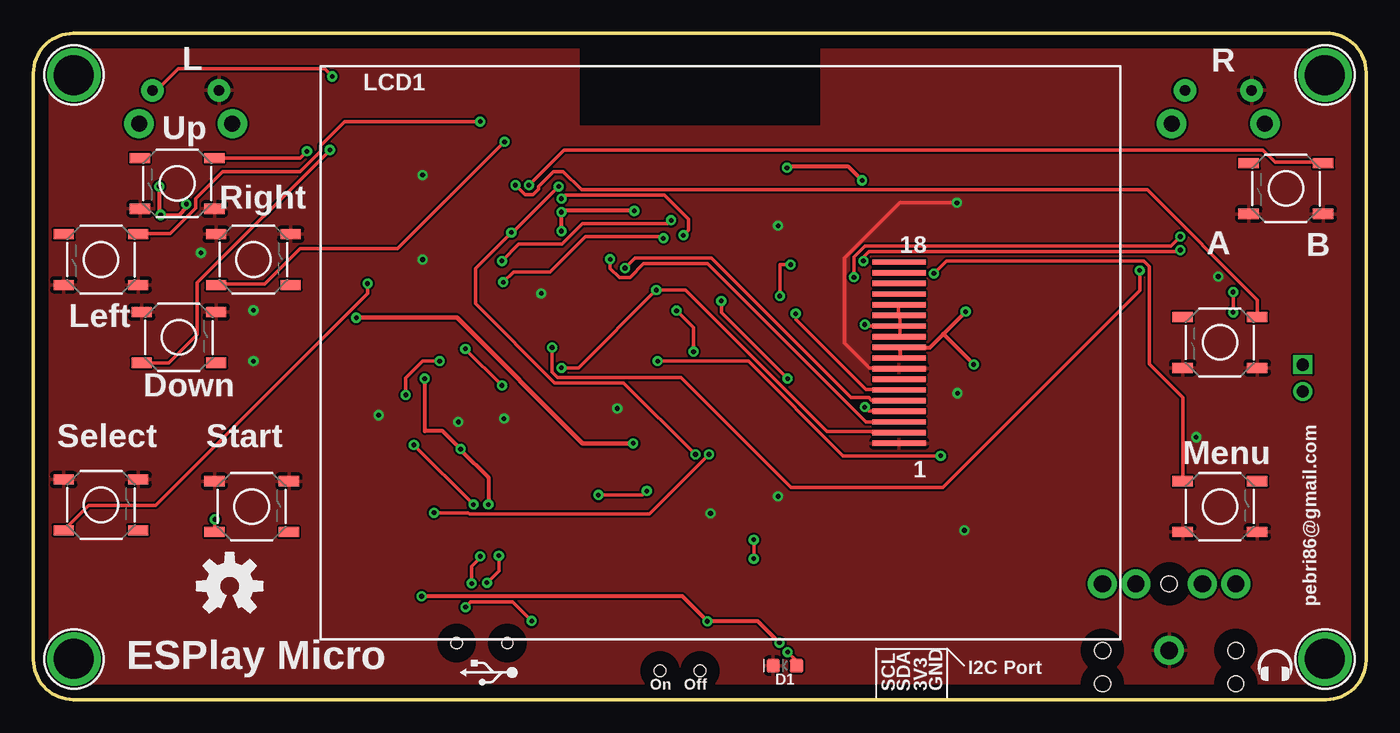
[diagram p2: board, top side]
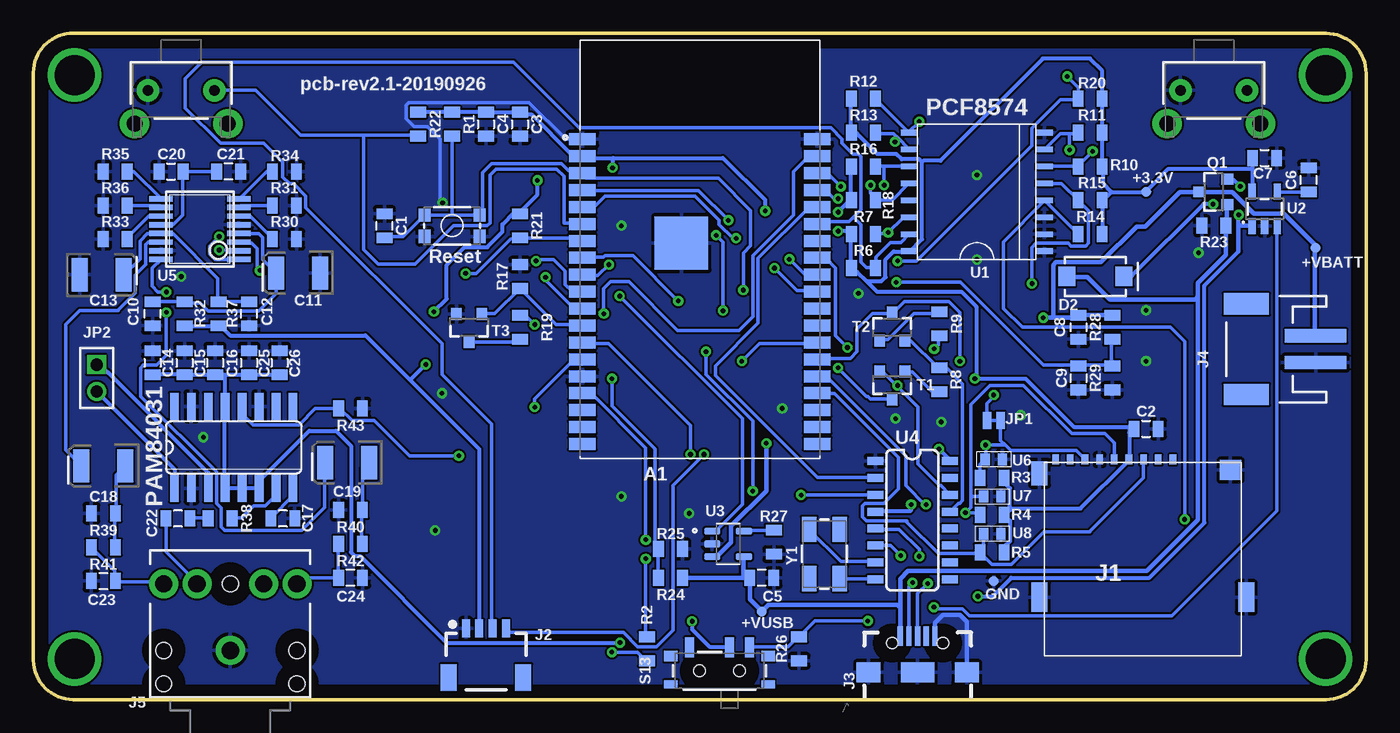
[diagram p3: board, bottom side, seen from below]

Size 100 x 50 mm. Coordinates in mm from the lower left corner, seen from the top.
Outline: 3,0 97,0 arc89 100,2.94 100,47.06 arc90 97,50 3,50 arc90 0,47 0,3 arc90 3,0
Copper layers (1*16): Top 0.035mm / dielectric 1.5mm / Bottom 0.035mm
Design rules "default": minimum track width 6mil, minimum drill 0.35mm, track to track 6mil, track to pad 6mil, pad to pad 6mil, via to via 6mil, smd to smd 6mil, copper to edge 40mil, drill to drill 6mil, minimum pad ring 10mil, minimum via ring 8mil, stop-mask expansion 4mil, vias tented up to drill 0mil, thermal gap 10mil

### Footprints (pad centres in the part's own frame; a part is rotated, then mirrored left to right if it is on the bottom)
XCVR_ESP32-WROVER-I = smd 2 x 0.9: 1 -8.81,8.26; 2 -8.81,6.99; 3 -8.81,5.72; 4 -8.81,4.45; 5 -8.81,3.18; 6 -8.81,1.91; 7 -8.81,0.64; 8 -8.81,-0.63; 9 -8.81,-1.9; 10 -8.81,-3.17; 11 -8.81,-4.44; 12 -8.81,-5.71; 13 -8.81,-6.98; 14 -8.81,-8.25; 15 -8.81,-9.52; 16 -8.81,-10.79; 17 -8.81,-12.06; 18 -8.81,-13.33; 19 -8.81,-14.6; 20 8.81,-14.6; 21 8.81,-13.33; 22 8.81,-12.06; 23 8.81,-10.79; 24 8.81,-9.52; 25 8.81,-8.25; 26 8.81,-6.98; 27 8.81,-5.71; 28 8.81,-4.44; 29 8.81,-3.17; 30 8.81,-1.9; 31 8.81,-0.63; 32 8.81,0.64; 33 8.81,1.91; 34 8.81,3.18; 35 8.81,4.45; 36 8.81,5.72; 37 8.81,6.99; 38 8.81,8.26 | smd 4 x 4: 39 -1.38,0.47
0805 = smd 0.8 x 1.2: 1 -0.9,0; 2 0.9,0
EIA3528 = smd 1.2 x 2.5: A 1.65,0; C -1.65,0
LED-0603 = smd 1 x 1: A -0.877,0; C 0.877,0
SMA-DIODE = smd 1.27 x 1.47: A -2.15,0; C 2.15,0
MICROBUILDER_MOUNTINGHOLE_3.0_PLATEDTHIN = drill 3 pad 3.6: P$1 0,0
MICROSD-PUSH-OUT = smd 0.5 x 0.75: 1 9.625,0.225; 2 8.525,0.225; 3 7.425,0.225; 4 6.325,0.225; 5 5.225,0.225; 6 4.125,0.225; 7 3.025,0.225; 8 1.925,0.225; CD 0.825,0.225 | smd 1.2 x 1.8: G1 -0.375,-0.8 | smd 1.2 x 2.2: G2 -0.375,-10.1; G4 15.125,-10.1 | smd 1.6 x 1.5: G3 13.95,-0.55
1X04_1MM_RA = smd 0.6 x 1.35: 1 -1.5,0; 2 -0.5,0; 3 0.5,0; 4 1.5,0 | smd 1.2 x 2: NC1 2.8,-3.675; NC2 -2.8,-3.675
USB-B-MICRO-SMD = smd 1.45 x 0.4: D+ 2.725,0; D- 2.725,0.65; GND 2.725,-1.3; ID 2.725,-0.65; VBUS 2.725,1.3 | smd 1.5 x 1.8: SHIELD1 0,3.685; SHIELD2 0,-3.685 | smd 1.5 x 2.5: SHIELD3 0,0 | hole 0.85: 2.2,1.9; 2.2,-1.9
JST-2-SMD = smd 1 x 4.6: 1 -1,-3.7; 2 1,-3.7 | smd 1.6 x 3.4: NC1 -3.4,1.5; NC2 3.4,1.5
AUDIO-JACK = drill 1.3 pad 2.184: RING 5,5; RSH 5,2.5; SLEEVE 0,0; TIP 5,-5; TSH 5,-2.5 | hole 1.2: 0,5; -2.5,5; -2.5,-5; 0,-5; 5,0
SMT-JUMPER_2_NC_TRACE_NO-SILK = smd 0.635 x 1.27: 1 -0.508,0; 2 0.508,0
1X02M = drill 0.914 square: 1 -1,0 | drill 0.914: 2 1,0
ILI9341-2.4 = smd 4 x 0.4: P$1 -13.4,6.8; P$2 -13.4,6; P$3 -13.4,5.2; P$4 -13.4,4.4; P$5 -13.4,3.6; P$6 -13.4,2.8; P$7 -13.4,2; P$8 -13.4,1.2; P$9 -13.4,0.4; P$10 -13.4,-0.4; P$11 -13.4,-1.2; P$12 -13.4,-2; P$13 -13.4,-2.8; P$14 -13.4,-3.6; P$15 -13.4,-4.4; P$16 -13.4,-5.2; P$17 -13.4,-6; P$18 -13.4,-6.8
SOP-16 = smd 0.66 x 2.032: 1 -4.445,-3.073; 2 -3.175,-3.073; 3 -1.905,-3.073; 4 -0.635,-3.073; 5 0.635,-3.073; 6 1.905,-3.073; 7 3.175,-3.073; 8 4.445,-3.073; 9 4.445,3.073; 10 3.175,3.073; 11 1.905,3.073; 12 0.635,3.073; 13 -0.635,3.073; 14 -1.905,3.073; 15 -3.175,3.073; 16 -4.445,3.073
SOT23-3 = smd 0.8 x 0.9: 1 -0.95,-1; 2 0.95,-1; 3 0,1.1
TACTILE_SWITCH_SMD_4.6X2.8MM = smd 0.9 x 1: 1 -2.05,-0.8; 2 2.05,-0.8; 3 2.05,0.8; 4 -2.05,0.8
TACTILE_SWITCH_SMD_5.2MM = smd 1.524 x 0.762: 1 -2.794,1.905; 2 2.794,1.905; 3 -2.794,-1.905; 4 2.794,-1.905
TACTILE_SWITCH_PTH_RIGHT_ANGLE_KIT = drill 0.8 pad 1.7: 1 -2.5,0; 2 2.5,0 | drill 1.2 pad 2.2: ANCHOR1 -3.5,2.5; ANCHOR2 3.5,2.5
SWITCH_SPST_SMD_A = smd 0.7 x 1.5: 1 -2.25,-1.75; 2 -0.75,-1.75; 3 2.25,-1.75 | smd 1 x 0.6: GND1 -3.65,1; GND3 3.65,1 | smd 1 x 0.8: GND2 -3.65,-1.1; GND4 3.65,-1.1 | hole 0.9: -1.5,0; 1.5,0
PAD.03X.03 = smd 0.762 x 0.762: P$1 0,0
SO16 = smd 1.27 x 0.419: 1 -5.08,4.445; 2 -5.08,3.175; 3 -5.08,1.905; 4 -5.08,0.635; 5 -5.08,-0.635; 6 -5.08,-1.905; 7 -5.08,-3.175; 8 -5.08,-4.445; 9 5.08,-4.445; 10 5.08,-3.175; 11 5.08,-1.905; 12 5.08,-0.635; 13 5.08,0.635; 14 5.08,1.905; 15 5.08,3.175; 16 5.08,4.445
SOT23-5 = smd 0.55 x 1.2: 1 -0.95,-1.3; 2 0,-1.3; 3 0.95,-1.3; 4 0.95,1.3; 5 -0.95,1.3
SOT95P280X100-5N = smd 1.24 x 0.55: 1 -1.185,0.95; 2 -1.185,0; 3 -1.185,-0.95; 4 1.185,-0.95; 5 1.185,0.95
SO016 = smd 0.6 x 1.2: 1 -4.445,-2.8; 2 -3.175,-2.8; 3 -1.905,-2.8; 4 -0.635,-2.8; 5 0.635,-2.8; 6 1.905,-2.8; 7 3.175,-2.8; 8 4.445,-2.8; 9 4.445,2.8; 10 3.175,2.8; 11 1.905,2.8; 12 0.635,2.8; 13 -0.635,2.8; 14 -1.905,2.8; 15 -3.175,2.8; 16 -4.445,2.8
MICROBUILDER_SSOP16_4.4MM = smd 0.4 x 1.75: 1 -2.275,-2.92; 2 -1.625,-2.92; 3 -0.975,-2.92; 4 -0.325,-2.92; 5 0.325,-2.92; 6 0.975,-2.92; 7 1.625,-2.92; 8 2.275,-2.92; 9 2.275,2.92; 10 1.625,2.92; 11 0.975,2.92; 12 0.325,2.92; 13 -0.325,2.92; 14 -0.975,2.92; 15 -1.625,2.92; 16 -2.275,2.92
ESD0402 = smd 0.7 x 0.9: 1 -0.65,0; 2 0.65,0
CRYSTAL-SMD-5X3.2-4PAD = smd 1.9 x 1.1: 1 -1.85,-1.15; 2 1.85,-1.15; 3 1.85,1.15; 4 -1.85,1.15

### Placement (x,y rotation side)
A1  50,33.78 0 bottom
C1  73.66,35.56 90 bottom
C2  16.51,20.32 0 bottom
C3  63.5,43.18 270 bottom
C4  66.04,43.18 270 bottom
C5  45.34,9.14 180 bottom
C6  4.32,38.99 90 bottom
C7  7.62,40.64 0 bottom
C8  21.59,27.94 270 bottom
C9  21.59,24.13 270 bottom
C10  91.06,28.96 90 bottom
C11  80.14,32 180 bottom
C12  83.82,28.96 90 bottom
C13  94.87,31.88 0 bottom
C14  91.06,25.27 270 bottom
C15  88.65,25.27 270 bottom
C16  86.36,25.27 270 bottom
C17  81.28,13.59 180 bottom
C18  94.74,17.53 180 bottom
C19  76.45,17.78 180 bottom
C20  89.66,39.62 0 bottom
C21  85.34,39.62 180 bottom
C22  89.15,13.59 180 bottom
C23  94.74,8.89 0 bottom
C24  76.2,9.14 180 bottom
C25  83.82,25.27 270 bottom
C26  81.53,25.27 270 bottom
D1  56.39,2.54 180 top
D2  20.32,31.75 0 bottom
H1  3.05,3.05 0 top
H2  3.05,46.86 0 top
H3  96.9,46.86 0 top
H4  96.9,3.05 0 top
J1  24.13,17.78 0 bottom
J2  66.04,5.33 0 bottom
J3  33.66,2.03 90 bottom
J4  7.49,26.29 90 bottom
J5  85.22,3.68 90 bottom
JP1  27.94,20.95 180 bottom
JP2  95.25,24.13 270 bottom
LCD1  51.56,26.04 180 top
PAM84031  84.96,18.92 0 bottom
Q1  11.43,38.1 90 bottom
R1  68.58,43.18 90 bottom
R2  53.98,3.81 90 bottom
R3  28.07,16.64 180 bottom
R4  28.07,13.84 180 bottom
R5  28.07,11.05 180 bottom
R6  37.72,32.38 0 bottom
R7  37.72,34.92 0 bottom
R8  32,24 90 bottom
R9  32,28.19 270 bottom
R10  20.7,40.01 180 bottom
R11  20.7,42.55 180 bottom
R12  37.72,45.09 0 bottom
R13  37.72,42.55 0 bottom
R14  20.7,34.92 180 bottom
R15  20.7,37.47 180 bottom
R16  37.72,40.01 0 bottom
R17  63.5,31.75 90 bottom
R18  37.72,37.47 0 bottom
R19  63.5,27.94 270 bottom
R20  20.7,45.09 180 bottom
R21  63.5,35.56 270 bottom
R22  71.12,43.18 270 bottom
R23  11.43,35.56 0 bottom
R24  52.2,9.14 180 bottom
R25  52.2,11.3 180 bottom
R26  42.55,3.81 90 bottom
R27  44.45,11.81 90 bottom
R28  19.05,27.94 270 bottom
R29  19.05,24.13 270 bottom
R30  81.15,34.54 180 bottom
R31  81.15,37.08 180 bottom
R32  88.65,28.96 270 bottom
R33  93.85,34.54 0 bottom
R34  81.15,39.62 180 bottom
R35  93.85,39.62 0 bottom
R36  93.85,37.08 0 bottom
R37  86.11,28.96 270 bottom
R38  85.98,13.59 0 bottom
R39  94.74,13.97 0 bottom
R40  76.2,14.22 0 bottom
R41  94.74,11.43 180 bottom
R42  76.2,11.68 180 bottom
R43  76.2,21.84 180 bottom
S1  68.58,35.56 0 bottom
S2  10.79,38.73 180 top
S3  10.92,27.18 0 top
S4  5.08,33.02 180 top
S5  16.51,33.02 0 top
S6  16.38,14.48 0 top
S7  5.08,14.61 0 top
S8  89.03,26.8 180 top
S9  93.98,38.35 180 top
S10  11.43,45.72 180 bottom
S11  89.03,14.48 0 top
S12  88.9,45.72 180 bottom
S13  48.51,2.16 180 bottom
T1  35.56,23.62 180 bottom
T2  35.56,27.94 0 bottom
T3  67.31,27.94 180 bottom
TP1  45.34,6.6 0 bottom
TP2  3.81,33.91 0 bottom
TP3  16.51,38.1 0 bottom
TP4  27.94,8.89 0 bottom
U1  29.21,38.1 180 bottom
U2  7.62,36.83 0 bottom
U3  47.88,11.68 0 bottom
U4  34.04,13.46 270 bottom
U5  87.5,35.31 90 bottom
U6  27.94,18.03 0 bottom
U7  28.05,15.24 0 bottom
U8  28.05,12.45 0 bottom
U$1  [OSHW-LOGO-M]  14.73,8.51 0 top
U$2  [USB_LOGO]  34.29,2.03 180 top
U$3  [HEADPHONE_LOGO]  92.33,1.52 0 top
Y1  40.64,10.92 90 bottom

### Tracks (layer width: path | path; a pad name or v marks a point on that pad's centre or on a via)
3.3V  (via drill 0.35)
  Top 0.305: v29.36,24.08 29.36,20.14 30.71,20.14 v32.05,18.8 32.11,18.69 34.14,16.66 v34.14,14.63 | v39.62,35.15 v39.62,36.58 39.73,36.68 v45.09,36.68 | 68.28,27.43 67.26,26.42 65.02,26.42 LCD1.P$10 65.02,26.31 65.02,25.7 LCD1.P$9 | 68.28,27.43 v69.95,29.11 | v62.18,38.96 61.16,39.98 56.62,39.98 v56.54,39.9 | v70.56,25.15 68.28,27.43
  Bottom 0.305: U4.4 36.78,14.15 34.21,14.15 34.14,14.22 v34.14,14.63 | 17.78,20.02 17.78,20.47 21.95,20.47 25.55,24.08 v29.36,24.08 29.26,24.18 29.26,29.49 30.38,30.61 36.7,30.61 37.49,31.39 | 17.78,20.02 17.78,18.09 J1.4 17.88,17.88 21.44,14.33 26.72,14.33 | 17.78,20.02 17.48,20.32 C2.1 | v32.05,18.8 31.21,17.95 U4.16 | R12.1 38.71,45.01 38.71,42.57 R13.1 38.51,42.47 38.2,42.47 36.68,40.95 35.26,40.95 34.85,40.54 33.53,40.54 33.33,40.34 | R16.1 38.71,39.93 38.71,37.49 R18.1 38.81,37.39 v39.62,36.58 | 37.49,31.39 36.37,31.39 36.07,31.7 36.07,33.02 35.46,33.63 34.34,33.63 U1.16 34.24,33.63 33.33,34.54 33.33,40.34 | 37.49,31.39 38.19,32.1 R6.1 38.71,32.41 38.71,34.85 R7.1 38.81,34.95 39.01,35.15 v39.62,35.15 | 8.53,39.83 8.53,40.64 C7.1 | 8.53,39.83 8.53,38.2 U2.5 | 19.1,38.1 TP3.P$1 16.46,38.2 14.83,39.83 8.53,39.83 | 19.1,38.1 19.71,37.49 R15.1 19.81,37.39 19.81,34.95 R14.1 | 19.1,38.1 19.71,38.71 19.71,39.93 R10.1 19.81,40.13 19.81,42.47 R11.1 19.81,42.67 19.81,45.01 R20.1 19.81,45.21 19.81,47.19 20.73,48.11 24.26,48.11 31.93,40.44 33.22,40.44 33.33,40.34 | R22.1 71.12,44.09 68.68,44.09 R1.2 68.58,44.09 66.14,44.09 C4.1 66.04,44.09 63.5,44.09 C3.1 63.4,43.89 62.59,43.89 59.64,40.95 58.93,40.95 A1.2 58.73,40.64 56.49,40.64 | v69.95,29.11 68.99,30.07 68.99,32.61 67.64,33.95 65.95,33.95 64.8,35.11 64.8,35.66 63.88,36.58 63.5,36.58 | v62.18,38.96 62.18,37.9 63.5,36.58 | 63.5,36.58 R21.1 | R32.2 88.59,28.04 86.16,28.04 R37.2 85.95,28.04 85.24,27.33 75.08,27.33 71.73,23.98 | 71.73,23.98 66.55,18.8 66.55,5.38 J2.2 | 71.73,23.98 v70.56,25.15 | v45.09,36.68 45.09,37.47 48.26,40.64 56.49,40.64
  Bottom 0.305: 56.49,40.64 56.49,39.93 v56.54,39.9 | R5.1 27.13,11.07 27.13,11.48 26.72,11.89 26.72,13.41 27.13,13.82 R4.1 27.03,13.92 26.72,14.22 26.72,14.33 | 26.72,14.33 26.72,15.85 27.13,16.26 27.13,16.56 R3.1
A  (via drill 0.35)
  Top 0.254: v36.17,38.61 36.88,37.9 37.49,37.9 37.9,38.3 37.9,38.51 39.01,39.62 39.75,39.62 41.12,38.25 83.57,38.25 91.85,29.97 91.85,28.75 S8.3
  Bottom 0.254: 36.17,40.03 34.34,40.03 U1.11 | 36.17,40.03 36.78,40.03 R16.2 | 36.17,40.03 v36.17,38.61
AUDIO_SHDN  (via drill 0.35)
  Top 0.254: v46.84,25.4 53.65,25.4 60.76,18.29 v68.07,18.29
  Bottom 0.254: PAM84031.12 84.33,21.44 83.52,20.62 80.06,20.62 78.84,21.84 R43.2 77.01,21.84 76.1,20.93 74.42,20.93 71.78,18.29 v68.07,18.29 | v46.84,25.4 45.52,26.72 41.25,26.72 A1.26
B  (via drill 0.35)
  Top 0.254: v37.19,38.61 39.83,41.25 92.25,41.25 93.17,40.34 96.72,40.34 S9.3
  Bottom 0.254: U1.12 34.34,38.71 35.56,37.49 36.78,37.49 R18.2 36.78,37.59 37.19,38 v37.19,38.61
CHRG_STAT  (via drill 0.35)
  Top 0.254: v56.01,30.28 56.01,32.64 v56.82,32.64
  Bottom 0.254: v56.01,30.28 46.81,21.08 46.81,14.63 48.81,12.63 | v56.82,32.64 57.66,31.8 58.73,31.8 A1.9
  Bottom 0.305: 48.81,12.63 U3.1
D+  (via drill 0.35)
  Top 0.254: v33.53,10.74 33.53,10.62 32.89,9.98 v32.89,8.71
  Bottom 0.254: v33.53,10.74 33.53,11.25 35.05,12.78 36.72,12.78 U4.5 | v32.89,8.71 33.66,7.95 J3.D+
D-  (via drill 0.35)
  Top 0.254: v34.04,8.76 34.92,9.65 v34.92,10.79
  Bottom 0.254: v34.04,8.76 34.3,8.49 J3.D- | v34.92,10.79 35.69,11.56 U4.6
DOWN  (via drill 0.35)
  Top 0.254: S3.3 10.16,25.27 12.29,27.41 12.29,31.29 v22.25,41.25
  Bottom 0.254: 22.25,42.47 22.96,42.47 24.08,41.35 U1.7 | 22.25,42.47 21.64,42.47 R11.2 | 22.25,42.47 v22.25,41.25
DTR
  Bottom 0.254: U4.13 31.19,14.12 30.58,14.73 30.48,14.73 30.28,14.94 30.28,23.7 31.48,24.9 R8.2 32.21,24.99 34.14,26.92 34.54,26.92 T2.2
GND  (via drill 0.35)
  Top 0.254: v69.29,37.29 65.02,37.29 60.86,33.12 60.86,26.75 62.71,24.89 64.92,24.89 LCD1.P$8
  Bottom 0.254: v69.29,37.29 69.49,37.49 69.49,42.06 70.41,42.98 71.42,42.98 72.03,43.59 72.03,44.6 71.83,44.81 62.79,44.81 60.02,42.04 A1.1
  Bottom 0.356: J3.GND 32.35,5.75 31.75,6.35 30.48,6.35 29.97,5.84 J3.SHIELD2
  other vias: 69.34,22.99 16.51,29.21 25.91,21.34 31.88,20.83 29.21,39.37 50.8,13.97 55.88,35.56 88.9,31.75 69.85,12.7 87.25,19.68 12.57,33.53 43.81,21.84 16.51,25.4 29.21,33.02 55.88,15.24 35.31,21.08 38.1,30.48
  pour Top: -2.54,52.07 102.87,52.07 102.87,-2.54 -2.54,-2.54
  pour Bottom: -5.08,54.61 105.41,54.61 105.41,-4.83 -5.08,-4.83
I2C_SCL  (via drill 0.35)
  Top 0.254: v49.68,18.39 44.3,23.77 39.12,23.77 33.17,29.72 33.17,32.36 v35.87,35.05 35.97,35.05 v39.42,38.51
  Bottom 0.254: 35.94,34.95 35.87,34.95 v35.87,35.05 | 35.94,34.95 36.78,34.95 R7.2 | 35.94,34.95 34.7,36.2 U1.14 | v49.68,18.39 52.02,16.05 52.02,5.18 53.24,3.96 54.66,3.96 55.73,5.03 64.4,5.03 J2.4 | v39.42,38.51 40.34,39.42 41.15,39.42 A1.36
I2C_SDA
  Bottom 0.254: 36.78,32.41 R6.2 | 38.46,36.22 38.81,35.87 41.05,35.87 41.15,35.76 A1.33 | 38.46,36.22 37.9,36.78 37.9,40.74 38.1,40.95 38.51,40.95 39.32,41.76 39.32,42.06 40.16,42.9 59.05,42.9 63.98,47.83 87.38,47.83 88.59,46.61 88.59,44.4 85.95,41.76 82.7,41.76 81.28,40.34 81.28,39.22 80.77,38.71 80.47,38.71 79.55,37.8 79.55,36.93 69.34,26.72 69.34,24.38 65.63,20.68 65.63,5.38 J2.3 | 38.46,36.22 37.9,35.66 37.9,32.82 37.49,32.41 36.78,32.41 | U1.15 34.92,34.29 35.69,34.29 36.78,33.2 36.78,32.41
I2S_BCK  (via drill 0.35)
  Top 0.254: v86.06,34.75 85.34,34.04 62.38,34.04 61.57,33.22 v61.57,31.7
  Bottom 0.254: v86.06,34.75 86.77,34.04 86.77,33.43 86.36,33.02 84.63,33.02 U5.1 | v61.57,31.7 61.57,31.5 59.44,29.36 58.83,29.36 A1.11
I2S_DIN  (via drill 0.35)
  Top 0.254: v83.01,32.21 83.01,30.68 68.25,15.93 56.84,15.93 48.59,24.18 39.32,24.18 38.91,24.59 v38.91,26.42
  Bottom 0.254: v83.01,32.21 83.21,32.41 83.21,33.83 83.62,34.24 84.53,34.24 U5.3 | v38.91,26.42 39.8,27.3 39.8,32.38 40.54,33.12 41.15,33.12 A1.31
I2S_LCK  (via drill 0.35)
  Top 0.254: v86.06,33.73 85.95,33.63 62.69,33.63 62.28,33.22 v62.28,32.92
  Bottom 0.254: v86.06,33.73 84.63,33.73 U5.2 | A1.10 59.56,30.61 60.09,31.14 60.09,32.15 60.96,33.02 62.18,33.02 v62.28,32.92
IO0  (via drill 0.35)
  Top 0.254: v30.48,25.4 29.21,25.4 27.94,24.13 v27.94,22.86
  Bottom 0.254: v27.94,22.86 27.94,22.73 28.45,22.23 JP1.2 | A1.25 41.05,25.6 38.71,25.6 38.2,26.11 38.2,27.79 37.03,28.96 35.56,28.96 T2.3 35.46,29.06 34.65,29.87 31.29,29.87 30.48,29.06 v30.48,25.4
L_BTN  (via drill 0.35)
  Top 0.254: v22.43,46.76 21.84,47.35 10.87,47.35 9.25,45.72 S10.1 | v47.85,35.97 47.6,35.71 41.2,35.71 39.67,34.19 36.42,34.19 v35.15,32.92
  Bottom 0.254: v22.43,46.76 21.6,45.93 R20.2 21.64,45.01 22.96,45.01 25.09,42.88 25.09,41.55 33.73,32.92 v35.15,32.92 | v47.85,35.97 50.09,38.2 58.73,38.2 A1.4
LCD_BCKL
  Bottom 0.254: A1.12 58.83,28.14 60.79,28.14 R17.1 65.39,28.96 66.34,28.96 T3.1
LCD_CS  (via drill 0.35)
  Top 0.254: v44.4,32.38 45.14,33.12 50.88,33.12 61.34,22.66 62.69,22.66 62.89,22.45 64.92,22.45 LCD1.P$5
  Bottom 0.254: v44.4,32.38 42.7,30.68 41.25,30.68 A1.29
LCD_DC  (via drill 0.35)
  Top 0.254: v62.38,21.95 62.69,21.64 64.92,21.64 LCD1.P$4
  Bottom 0.254: v62.38,21.95 62.38,22.55 59.44,25.5 58.83,25.5 A1.14
LCD_MOSI  (via drill 0.35)
  Top 0.254: v57.2,28.96 57.2,28.52 62.45,23.27 64.92,23.27 LCD1.P$6
  Bottom 0.254: v57.2,28.96 57.2,30.86 56.69,31.37 55.32,31.37 51.66,27.71 47.07,27.71 46.02,28.75 46.02,33.33 42.98,36.37 42.98,39.62 41.86,40.74 41.25,40.74 A1.37
LCD_SCK  (via drill 0.35)
  Top 0.254: v43.28,33.05 43.28,32.36 43.97,31.67 44.76,31.67 45.8,32.72 50.6,32.72 62.48,20.83 64.92,20.83 LCD1.P$3
  Bottom 0.254: A1.30 42.12,31.88 v43.28,33.05
LDAC
  Bottom 0.254: R41.2 95.61,11.38 93.88,9.65 93.88,8.94 C23.2 93.78,8.84 90.42,8.84 90.32,8.74 J5.RING
LEFT  (via drill 0.35)
  Top 0.254: v33.53,43.38 23.37,43.38 21.54,41.55 21.54,41.15 20.02,39.62 14.22,39.62 12.19,37.59 12.19,36.88 10.26,34.95 7.92,34.95 S4.3
  Bottom 0.254: 34.34,42.57 36.78,45.01 R12.2 | 34.34,42.57 v33.53,43.38 | 34.34,42.57 U1.9
MENU  (via drill 0.35)
  Top 0.254: v67.56,31.98 68.5,32.92 83.31,32.92 83.72,32.51 83.72,25.2 86.26,22.66 86.26,16.46 S11.1
  Bottom 0.254: A1.7 58.83,34.44 59.03,34.65 63.5,34.65 R21.2 64.19,34.56 66.78,31.98 v67.56,31.98
N$1  (via drill 0.35)
  Top 0.254: v54.05,11.99 v54.05,10.57
  Bottom 0.254: v54.05,10.57 54.05,4.78 R2.2 | v54.05,11.99 54.05,18.9 58.12,22.96 58.73,22.96 A1.16
N$2
  Bottom 0.254: R27.2 44.5,12.7 46.63,12.7 U3.5
N$3  (via drill 0.35)
  Top 0.254: v56.59,3.56 57.2,2.95 57.2,2.54 D1.A
  Bottom 0.254: v56.59,3.56 54.66,3.56 54.05,2.95 R2.1
N$4
  Bottom 0.254: U4.7 36.88,10.36 39.42,10.36 41.76,12.7 Y1.3
N$5
  Bottom 0.254: C18.A 97.59,18.72 97.59,28.14 96.52,29.21 93.62,29.21 93.62,29.23 92.34,30.51 92.34,31.87 91.58,32.63 91.58,34.15 91.4,34.33 U5.14
N$6
  Bottom 0.254: U4.8 36.88,9.04 39.42,9.04 Y1.1
N$7  (via drill 0.35)
  Top 0.254: v32.44,6.93 32.82,7.32 35.97,7.32 v37.39,5.89
  Bottom 0.254: v32.44,6.93 32.31,6.81 30.28,6.81 29.77,6.3 14.58,6.3 6.71,14.17 6.71,35.46 U2.3 | v37.39,5.89 41.35,5.89 42.47,4.78 R26.2 42.67,4.67 43.38,3.96 46.23,3.96 S13.1
N$9
  Bottom 0.254: T3.3 67.26,26.82 63.6,26.82 63.6,26.94 R19.2
N$10
  Bottom 0.254: C6.1 4.37,38.1 6.6,38.1 U2.4
N$11  (via drill 0.35)
  Top 0.254: v62.38,28.14 62.48,28.04 64.92,28.04 LCD1.P$12 | LCD1.P$11 65.02,27.33 65.02,27.94 LCD1.P$12 | LCD1.P$12 65.02,28.14 65.02,28.75 LCD1.P$13 64.92,28.96 64.92,29.57 LCD1.P$14
  Bottom 0.254: v62.38,28.14 62.99,28.75 63.5,28.75 R19.1
N$12
  Bottom 0.254: R8.1 32.58,23.1 32.61,23.16 34.04,24.59 34.54,24.59 T1.1
N$13
  Bottom 0.254: T2.1 36.47,27.03 35.87,27.03 33.93,28.96 32.31,28.96 R9.1
N$14  (via drill 0.35)
  Top 0.254: v90.02,29.06 v90.02,30.58
  Bottom 0.254: U5.16 91.08,32.37 91.08,31.01 90.65,30.58 v90.02,30.58 | v90.02,29.06 90.02,25.81 90.73,25.09 91.75,25.09 91.95,24.89 91.95,22.76 86.26,17.07 86.26,14.73 85.9,14.38 85.9,12.95 85.65,12.7 79.86,12.7 78.13,14.43 78.13,17.68 C19.A
N$16
  Bottom 0.254: 80.57,15.24 80.57,15.85 PAM84031.8 80.57,15.24 | 80.57,15.24 82.09,13.72 C17.2
N$17
  Bottom 0.254: R38.2 84.94,13.61 84.38,13.61 83.46,14.53 82.6,14.53 81.89,15.24 PAM84031.7
N$18
  Bottom 0.254: R41.1 93.88,11.48 93.88,13.92 R39.2 93.78,14.02 93.78,16.87 93.17,17.48 C18.C
N$19
  Bottom 0.254: R42.1 75.39,11.68 75.39,14.22 R40.2 75.29,14.33 75.29,17.37 74.88,17.78 C19.C
N$20
  Bottom 0.254: C12.2 86.06,29.87 R37.1 86.16,29.97 86.16,31.6 89.51,34.95 90.32,34.95 U5.13 90.42,34.95 91.47,34.95 92,34.42 92,33.07 93.17,31.9 C13.A
N$21
  Bottom 0.254: C21.2 C20.2 88.8,39.52 88.8,36.37 89.51,35.66 90.32,35.66 U5.12
N$22
  Bottom 0.254: C10.2 91.03,29.87 88.7,29.87 R32.1 88.59,29.77 87.48,29.77 86.87,29.16 83.11,29.16 81.79,30.48 81.79,31.9 C11.A 82.8,33.02 82.8,34.67 83.08,34.95 84.53,34.95 U5.4
N$23
  Bottom 0.254: R38.1 86.97,13.61 88.09,13.61 C22.1
N$24
  Bottom 0.254: R30.2 82.05,34.61 83.72,36.27 84.53,36.27 U5.6
N$25
  Bottom 0.254: R31.2 84.43,37.08 84.53,36.98 U5.7
N$26
  Bottom 0.254: R33.2 92.95,34.66 91.34,36.27 U5.11
N$27
  Bottom 0.254: R34.2 82.5,39.62 84.53,37.59 U5.8
N$28
  Bottom 0.254: R35.2 92.46,39.62 90.42,37.59 U5.9
N$29
  Bottom 0.254: R36.2 90.53,37.08 90.42,36.98 U5.10
N$30
  Bottom 0.254: C22.2 90.02,13.41 90.02,11.07 87.78,8.84 J5.RSH
R_BTN
  Bottom 0.254: 75.21,42.37 79.96,42.37 83.31,45.72 S12.1 | 75.21,42.37 71.12,42.37 R22.2 | 75.21,42.37 75.21,33.76 74.12,32.66 71.37,32.66 68.48,35.56 65.94,35.56 65.73,35.76 65.73,39.34 65.28,39.8 60.73,39.8 60.2,39.27 60.2,35.79 60.17,35.76 58.83,35.76 A1.6
RDAC
  Bottom 0.254: R42.2 77.11,11.68 77.11,9.14 C24.2 79.65,9.14 80.06,8.74 J5.TIP
RESET  (via drill 0.35)
  Top 0.254: v39.62,24.89 40.89,24.89 v46.74,30.73 48.92,30.73 59.54,20.12 62.89,20.12 62.99,20.02 64.92,20.02 LCD1.P$2
  Bottom 0.254: 68.58,36.37 70.61,36.37 S1.4 70.71,36.27 72.24,34.75 73.66,34.75 C1.1 | 68.58,36.37 66.55,36.37 S1.3 66.28,36.61 66.28,39.54 65.61,40.21 60.38,40.21 59.85,39.68 A1.3 58.52,39.12 48.59,39.12 46.18,36.7 46.18,34.06 46.74,33.5 v46.74,30.73 | 68.58,36.37 R1.1 | v39.62,24.89 37.49,22.76 37.39,22.76 37.19,22.55 35.56,22.55 T1.3
RIGHT  (via drill 0.35)
  Top 0.254: v35.36,41.86 27.33,33.83 20.02,33.83 17.37,31.19 13.72,31.19 S5.3
  Bottom 0.254: 35.1,42.11 34.34,41.35 U1.10 | 35.1,42.11 35.46,42.47 36.78,42.47 R13.2 | 35.1,42.11 v35.36,41.86
RTS  (via drill 0.35)
  Top 0.254: v35.15,23.57 v32.41,26.31
  Bottom 0.254: U4.14 31.29,15.44 31.9,16.05 32,16.05 33.63,17.68 33.63,21.95 35.2,23.52 | 35.2,23.52 36.37,24.69 T1.2 | v32.41,26.31 32.11,26.62 32.11,27.23 R9.2 | v35.15,23.57 35.2,23.52
RX  (via drill 0.35)
  Top 0.254: v42.39,15.34 45.72,15.34 v46.02,15.65 | v48.26,29.18 49.53,27.91 v49.53,26.11 | v48.77,34.85 49.15,35.23 49.15,36.07 47.37,37.85 39.88,37.85 v39.62,37.59
  Bottom 0.254: v42.39,15.34 36.88,15.34 U4.3 | v46.02,15.65 46.02,20.9 49.53,24.41 v49.53,26.11 | v48.26,29.18 48.26,34.34 v48.77,34.85 | v39.62,37.59 39.93,37.59 40.54,38.2 41.15,38.2 A1.35
SD_CLK  (via drill 0.35)
  Top 0.254: v30.07,14.02 32.61,14.02 32.72,13.92 46.23,13.92 v50.7,18.39
  Bottom 0.254: v50.7,18.39 50.7,20.57 56.84,26.72 58.73,26.72 A1.13 | 29.67,15.24 29.67,22.15 28.25,23.57 25.7,23.57 22.1,19.96 19.61,19.96 18.91,19.26 J1.5 | 29.67,15.24 U7.1 | 29.67,15.24 29.67,14.43 v30.07,14.02 28.96,14.02 28.96,13.85 R4.2
SD_CMD
  Bottom 0.254: J1.3 16.7,16.64 20.65,12.7 20.73,12.6 24.18,12.6 26.62,10.16 28.08,10.16 R5.2 | A1.23 41.15,22.96 39.9,22.96 35.1,18.16 35.1,15.8 36.17,14.73 37.59,14.73 37.8,14.53 37.8,13.72 37.49,13.41 34.44,13.41 34.44,13.31 32.11,10.97 32.1,10.98 29.04,10.98 R5.2 | R5.2 28.71,11.3 28.71,12.44 U8.1
SD_DAT0  (via drill 0.35)
  Top 0.254: v33.02,14.63 v28.55,19.1
  Bottom 0.254: J1.7 21.13,18.09 21.74,18.69 26.67,18.69 27.08,19.1 | A1.24 41.15,24.18 40.44,24.18 34.54,18.29 34.54,16.05 33.07,14.58 v33.02,14.63 | 27.08,19.1 v28.55,19.1 28.55,18.09 28.65,17.98 U6.1 28.97,17.66 R3.2 | 27.08,19.1 27.43,19.46 JP1.1
SELECT  (via drill 0.35)
  Top 0.254: S7.3 4.15,14.56 9.18,14.56 25.07,30.45 v25.07,31.22
  Bottom 0.254: v25.07,31.22 25.07,33.3 25.09,33.33 25.09,33.93 24.79,34.24 22.35,34.24 22.15,34.04 21.03,34.04 20.83,34.24 20.83,36.68 21.54,37.39 | R15.2 22.87,38.73 U1.5
  Bottom 0.356: R15.2 21.6,37.45 21.54,37.39
SPK+
  Bottom 0.305: PAM84031.1 89.41,17.27 95.2,23.06 JP2.2
SPK-
  Bottom 0.305: PAM84031.3 86.87,17.02 94.39,24.54 JP2.1
START  (via drill 0.35)
  Top 0.254: v13.61,13.51 13.61,12.6 S6.3
  Bottom 0.254: R14.2 21.64,34.95 24.08,37.39 U1.4 24.18,37.39 27.23,34.34 27.23,29.36 25.81,27.94 14.68,27.94 13.61,26.87 v13.61,13.51
TX
  Bottom 0.254: U4.2 36.88,16.66 41.17,16.66 48.82,24.31 48.82,25.04 45.62,28.25 45.62,33.12 41.86,36.88 41.25,36.88 A1.34
UP  (via drill 0.35)
  Top 0.254: S2.3 20.02,40.64 v20.52,41.15
  Bottom 0.254: 21.64,40.03 24.08,40.03 U1.6 | 21.64,40.03 v20.52,41.15 | 21.64,40.03 R10.2
USB_DET  (via drill 0.35)
  Top 0.254: v51.61,29.92 51.61,29.06 v56.59,24.08
  Bottom 0.254: R24.2 53.14,9.14 53.14,11.28 R25.2 53.34,11.38 53.34,18.8 56.59,22.05 v56.59,24.08 | v51.61,29.92 55.02,33.33 57.1,33.33 57.2,33.22 58.73,33.22 A1.8
V_BATT  (via drill 0.35)
  Top 0.356: v24.23,28.65 31.77,28.65 41.2,19.23 v45.01,19.23
  Bottom 0.356: J4.2 3.86,27.33 3.86,33.83 TP2.P$1 3.76,34.04 6.2,36.47 8.43,36.47 10.06,38.1 Q1.3 13.99,38.1 16.59,35.51 17.22,35.51 19.91,32.82 23.27,32.82 23.47,32.61 23.47,28.65 | R28.1 19.1,28.85 21.54,28.85 C8.1 21.74,28.75 21.84,28.65 23.47,28.65 | 23.47,28.65 v24.23,28.65 | U3.3 48.97,10.77 48.67,10.77 47.65,11.79 47.65,13.02 45.01,15.66 v45.01,19.23
V_USB
  Bottom 0.356: 46.74,9.14 C5.2 46.24,7.5 TP1.P$1 44.83,7.11 35.18,7.11 34.95,6.89 J3.VBUS 34.95,9.06 34.37,9.65 16.46,9.65 12.62,13.49 12.62,30.16 12.69,30.16 | 46.74,9.14 R24.1 | 46.74,9.14 46.74,10.67 U3.4 | Q1.1 10.46,37.08 10.46,35.56 R23.2 10.53,33.36 12.62,31.27 12.62,30.1 12.69,30.16 | D2.A 22.45,31.7 20.9,31.7 19.24,30.04 12.83,30.04 12.7,30.16 12.69,30.16
VBAT_S  (via drill 0.35)
  Top 0.254: v47.27,34.62 47.14,34.75 41.43,34.75 38.76,32.08 36.02,32.08 v35.26,31.32
  Bottom 0.254: R28.2 19.1,27.03 19.1,25.09 R29.1 19.2,25.09 21.54,25.09 C9.1 21.64,25.09 24.21,25.09 30.43,31.32 v35.26,31.32 | A1.5 57.92,36.96 57.11,37.77 50.34,37.77 48.56,35.99 48.56,35.66 47.52,34.62 v47.27,34.62
VIN  (via drill 0.35)
  Top 0.305: v9.45,38.51 9.45,36.47 v9.55,36.37 10.95,36.37 11.48,36.91 v11.48,37.19 | v55.98,4.27 54.38,5.87 v50.57,5.87 48.69,7.75 v29.13,7.75
  Bottom 0.305: v9.45,38.51 9.96,39.01 10.36,39.01 Q1.2 | v11.48,37.19 12.19,37.19 17.58,31.8 18.09,31.8 D2.C | C26.2 81.58,24.38 83.82,24.38 C25.2 83.92,24.38 85.65,24.38 | C14.2 91.03,24.38 88.8,24.38 C15.2 88.59,24.38 86.36,24.38 C16.2 86.26,24.38 85.65,24.38 | 85.65,24.38 85.65,22.05 PAM84031.13 85.65,21.95 85.65,15.95 PAM84031.4 PAM84031.5 PAM84031.6 83.01,15.85 83.01,16.46 79.3,20.17 77.29,20.17 76.17,19.05 76.17,11.05 75.89,10.77 75.49,10.77 68.99,4.27 v55.98,4.27 | v50.57,5.87 50.57,5.26 49.28,3.96 47.85,3.96 S13.2 | 9.59,33.62 12.14,31.07 12.14,13.26 16.26,9.14 26.62,9.14 28.02,7.75 v29.13,7.75
  Bottom 0.356: 9.59,33.62 9.59,35.56 | v9.55,36.37 9.59,36.34 9.59,35.56 | U2.1 8.6,35.56 9.59,35.56

### Text on the board
tPlace: On | Off | I2C Port | SCL | SDA | 3V3 | GND
bPlace: +3.3V | Reset | +VBATT | GND | +VUSB
tNames: L | R | Up | Right | A | B | Left | Down | Select | Start | Menu | pebri86@gmail.com | ESPlay Micro
bNames: pcb-rev2.1-20190926